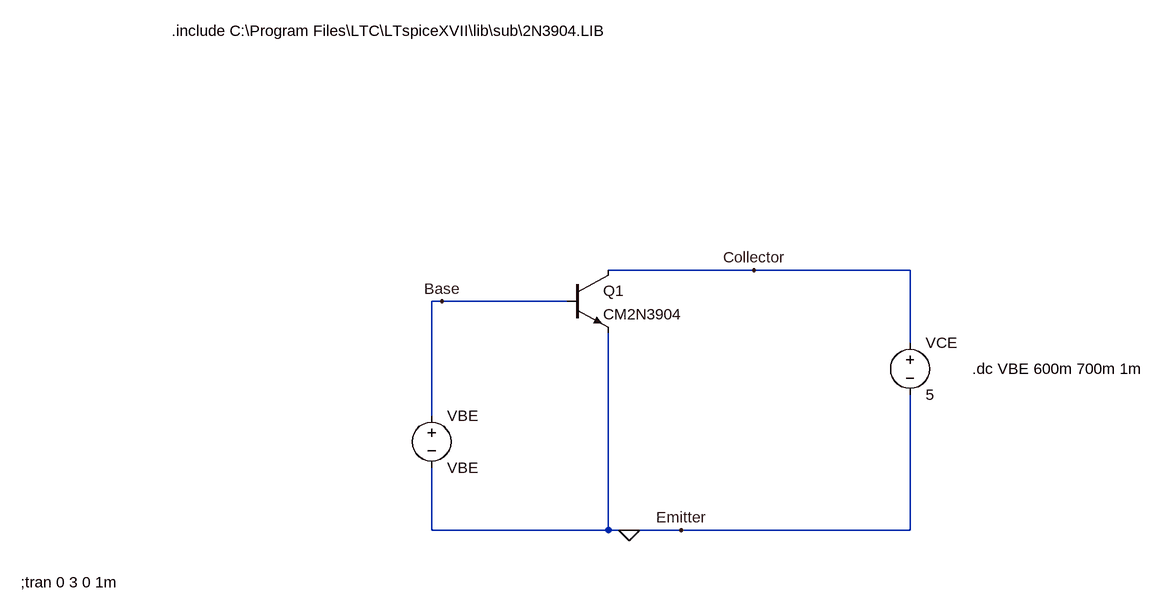
[diagram p0: schematic mp2 task 1B i) 2N3904 profiling.asc]
mp2 task 1B i) 2N3904 profiling.asc, the LTspice schematic file:
Version 4
SHEET 1 2560 912
WIRE 1072 400 848 400
WIRE 1312 400 1072 400
WIRE 592 448 576 448
WIRE 784 448 592 448
WIRE 1312 512 1312 400
WIRE 576 624 576 448
WIRE 576 800 576 704
WIRE 848 800 848 496
WIRE 848 800 576 800
WIRE 880 800 848 800
WIRE 960 800 880 800
WIRE 1312 800 1312 592
WIRE 1312 800 960 800
FLAG 880 800 0
FLAG 592 448 Base
FLAG 1072 400 Collector
FLAG 960 800 Emitter
SYMBOL voltage 1312 496 R0
WINDOW 123 0 0 Left 0
WINDOW 39 0 0 Left 0
SYMATTR InstName VCE
SYMATTR Value 5
SYMBOL npn 784 400 R0
SYMATTR InstName Q1
SYMATTR Value CM2N3904
SYMBOL voltage 576 608 R0
SYMATTR InstName VBE
SYMATTR Value VBE
TEXT -56 880 Left 2 !;tran 0 3 0 1m
TEXT 176 32 Left 2 !.include C:\\Program Files\\LTC\\LTspiceXVII\\lib\\sub\\2N3904.LIB
TEXT 1408 552 Left 2 !.dc VBE 600m 700m 1m

The netlist it stands for:
* mp2 task 1B i) 2N3904 profiling.asc
VCE Collector 0 5
Q1 Collector Base 0 0 CM2N3904
VBE Base 0 VBE
.model NPN NPN
.model PNP PNP
.lib standard.bjt
;tran 0 3 0 1m
.include C:\Program Files\LTC\LTspiceXVII\lib\sub\2N3904.LIB
.dc VBE 600m 700m 1m
.backanno
.end

* Results of the author's LTspice run, read from the files saved beside the schematic
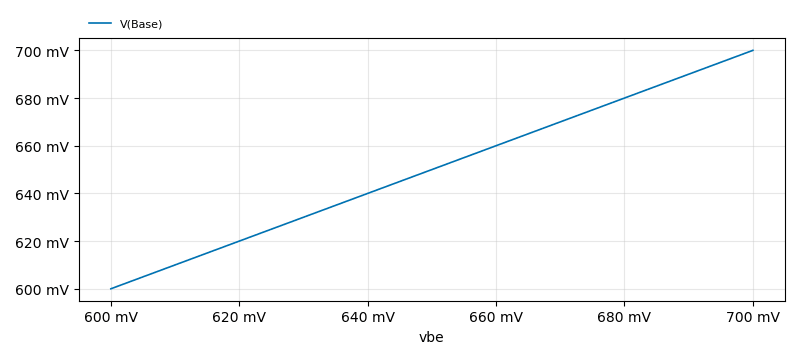
[diagram p1: DC transfer characteristic of mp2 task 1B i) 2N3904 profiling.asc, plotted from the saved traces]
* DC transfer characteristic, 1 run:
*   V(Base): 600 mV at vbe=600 mV, 700 mV at vbe=700 mV, min 600 mV, max 700 mV